# Altium schematic sheet Input_0.SchDoc
size A4
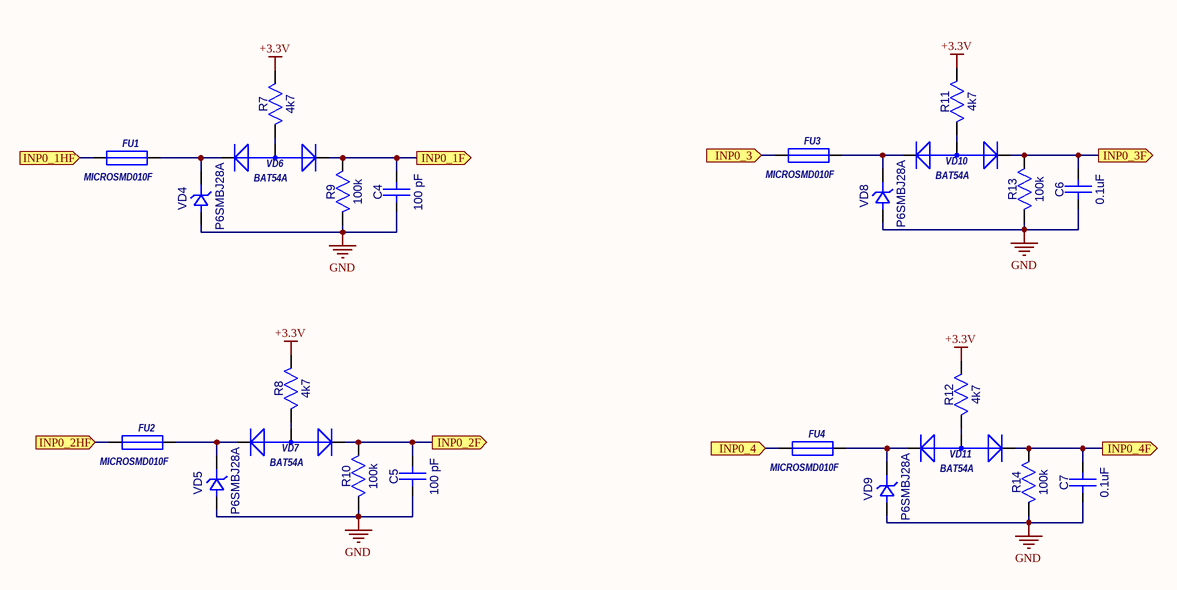
[diagram p0: Input_0.SchDoc]

## Parts
C4  100 pF  [CC0603-3M]
C5  100 pF  [CC0603-3M]
C6  0.1uF  [CC0603-3M]
C7  0.1uF  [CC0603-3M]
FU1  MICROSMD010F  [RC1210]
FU2  MICROSMD010F  [RC1210]
FU3  MICROSMD010F  [RC1210]
FU4  MICROSMD010F  [RC1210]
R7  4k7  [RC0603-3M]
R8  4k7  [RC0603-3M]
R9  100k  [RC0603-3M]
R10  100k  [RC0603-3M]
R11  4k7  [RC0603-3M]
R12  4k7  [RC0603-3M]
R13  100k  [RC0603-3M]
R14  100k  [RC0603-3M]
VD4  P6SMBJ28A  [SMB]
VD5  P6SMBJ28A  [SMB]
VD6  BAT54A  [SOT-23(123)]
VD7  BAT54A  [SOT-23(123)]
VD8  P6SMBJ28A  [SMB]
VD9  P6SMBJ28A  [SMB]
VD10  BAT54A  [SOT-23(123)]
VD11  BAT54A  [SOT-23(123)]

## Ports
INP0_1F (out), INP0_1HF (in), INP0_2F (out), INP0_2HF (in), INP0_3 (in), INP0_3F (out), INP0_4 (in), INP0_4F (out)

## Nets
+3.3V: R7.1(A) R8.1(A) R11.1(A) R12.1(A)
GND: C4.1(A) C5.1(A) C6.1(A) C7.1(A) R9.2(B) R10.2(B) R13.2(B) R14.2(B) VD4.1(A) VD5.1(A) VD8.1(A) VD9.1(A)
INP0_1F: C4.2(B) R9.1(A) VD6.2(K) ; port INP0_1F
INP0_1HF: FU1.2 ; port INP0_1HF
INP0_2F: C5.2(B) R10.1(A) VD7.2(K) ; port INP0_2F
INP0_2HF: FU2.2 ; port INP0_2HF
INP0_3: FU3.2 ; port INP0_3
INP0_3F: C6.2(B) R13.1(A) VD10.2(K) ; port INP0_3F
INP0_4: FU4.2 ; port INP0_4
INP0_4F: C7.2(B) R14.1(A) VD11.2(K) ; port INP0_4F
NetFU1_1: FU1.1 VD4.2(K) VD6.1(K)
NetFU2_1: FU2.1 VD5.2(K) VD7.1(K)
NetFU3_1: FU3.1 VD8.2(K) VD10.1(K)
NetFU4_1: FU4.1 VD9.2(K) VD11.1(K)
NetR7_2: R7.2(B) VD6.3(A)
NetR8_2: R8.2(B) VD7.3(A)
NetR11_2: R11.2(B) VD10.3(A)
NetR12_2: R12.2(B) VD11.3(A)

## Library data of the parts
C4-C7 = CC0603
  C4 C5: Value: 100 pF
  C6 C7: Value: 0.1uF
FU1-FU4 = MICROSMD: Value: MICROSMD010F
R7-R14 = RC0603
  R7 R8 R11 R12: Value: 4k7
  R9 R10 R13 R14: Value: 100k
VD4 VD5 VD8 VD9 = SMBJ: Value: P6SMBJ28A
VD6 VD7 VD10 VD11 = BAT54A: ComponentField6: Published 8-Jun-2000, Modified 11-July-2000: SIM Model Added.; Value: *